# EAGLE design BreadBoardPS_604 (EAGLE 7.1.0)
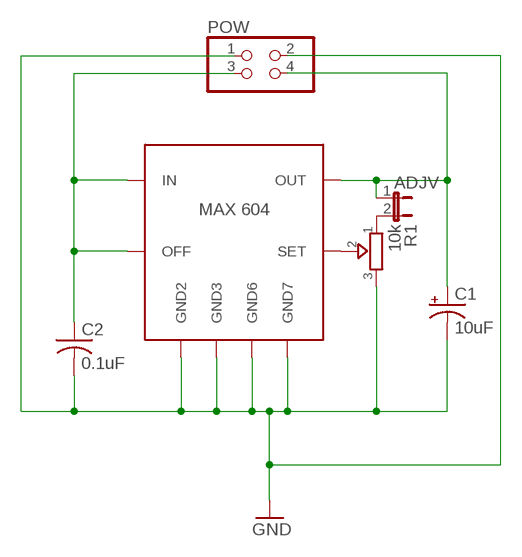
[diagram p0: schematic, sheet 1]

## Parts
ADJV  JP1E  [JP1]
C1  10uF  CPOL-USE2.5-5  [E2,5-5]
C2  0.1uF  C-US025-024X044  [C025-024X044]
MAX604  MAX604  [DIL08]
POW  PINHD-2X22X02/90NOSILK  [2X02/90]
R1  10k  TRIMMER-3306F  [TRIMMER_3306F]

## Nets
GND: C1.- C2.2 MAX604.2(GND2) MAX604.3(GND3) MAX604.6(GND6) MAX604.7(GND7) POW.1 POW.2 R1.3
N$1: C2.1 MAX604.1(IN) MAX604.4(OFF) POW.3
N$2: ADJV.2 R1.1
N$3: MAX604.5(SET) R1.2
N$5: ADJV.1 C1.+ MAX604.8(OUT) POW.4

## Library data of the parts
ADJV = jumper:JP1E: JUMPER
C1 = rcl:CPOL-US: POLARIZED CAPACITOR, American symbol
C2 = resistor:C-US: CAPACITOR, American symbol
MAX604 = modal:MAX604
POW = pinhead:PINHD-2X2: PIN HEADER
R1 = dp_devices:TRIMMER: Trimmer resistor

## Board
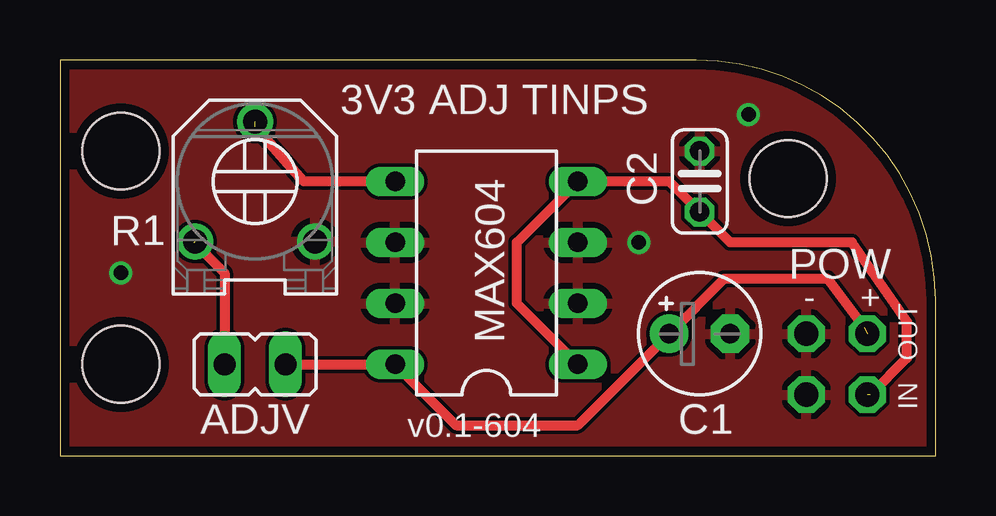
[diagram p1: board, top side]
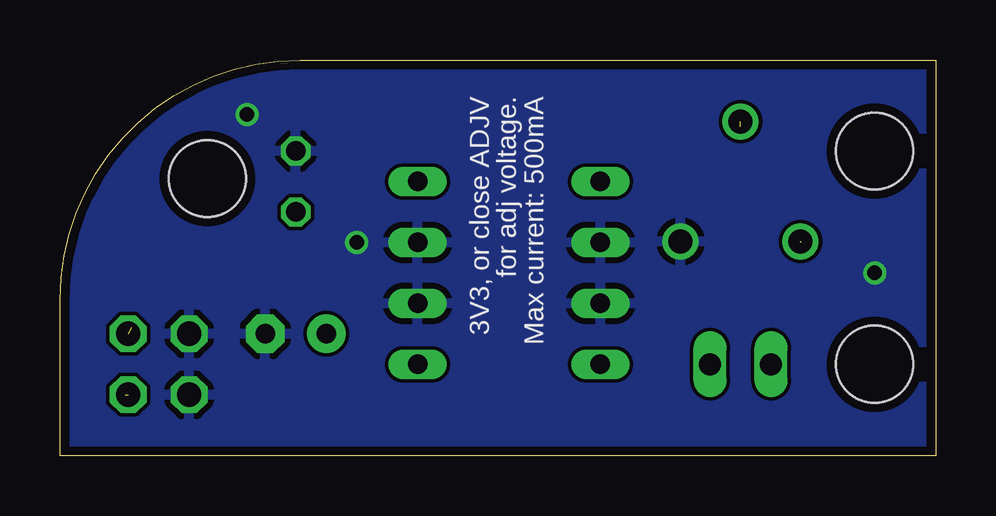
[diagram p2: board, bottom side, seen from below]

Size 36.5 x 16.5 mm. Coordinates in mm from the lower left corner, seen from the top.
Outline: 0,0 36.5,0 36.5,6.5 arc90 26.5,16.5 0,16.5 0,0
Copper layers (1*16): Top 0.0356mm / dielectric 1.5011mm / Bottom 0.0356mm
Design rules "LaenPCBOrder": minimum track width 6mil, minimum drill 13mil, track to track 6mil, track to pad 6mil, pad to pad 6mil, via to via 6mil, smd to smd 6mil, copper to edge 15mil, drill to drill 6mil, minimum pad ring 7mil, minimum via ring 7mil, stop-mask expansion 3mil, vias tented up to drill 0mil, thermal gap 10mil
Holes 3.2 mm at 2.54,12.7 2.54,3.81 30.35,11.56

### Footprints (pad centres in the part's own frame; a part is rotated, then mirrored left to right if it is on the bottom)
JP1 = drill 0.914 long: 1 0,-1.27; 2 0,1.27
E2,5-5 = drill 0.813 pad 1.6: + -1.27,0 | drill 0.813 pad 1.6 octagon: - 1.27,0
C025-024X044 = drill 0.813 octagon: 1 -1.27,0; 2 1.27,0
DIL08 = drill 0.813 long: 1 -3.81,-3.81; 2 -1.27,-3.81; 3 1.27,-3.81; 4 3.81,-3.81; 5 3.81,3.81; 6 1.27,3.81; 7 -1.27,3.81; 8 -3.81,3.81
2X02/90 = drill 1.016 octagon: 1 -1.27,-6.35; 2 -1.27,-3.81; 3 1.27,-6.35; 4 1.27,-3.81
TRIMMER_3306F = drill 1: 1 -2.5,-2.5; 2 0,2.5; 3 2.5,-2.5

### Placement (x,y rotation side)
ADJV  8.13,3.81 90 top
C1  26.67,5.08 0 top
C2  26.67,11.43 90 top
MAX604  17.78,7.62 90 top
POW  32.38,8.89 0 top
R1  8.13,11.43 0 top

### Tracks (layer width: path | path; a pad name or v marks a point on that pad's centre or on a via)
GND  (via drill 0.6)
  other vias: 2.54,7.62 28.7,14.22 24.13,8.89
  pour Top: -1.27,17.78 -1.27,-1.27 41.91,-1.27 41.91,17.78
  pour Bottom: -1.27,17.78 -1.27,-1.27 41.91,-1.27 41.91,17.78
N$1  (1 unrouted)
  Top 0.406: MAX604.1 19.05,6.35 19.05,8.89 MAX604.4 25.4,11.43 C2.1 27.94,8.89 33.02,8.89 35.31,5.59 35.31,4.06 33.78,2.54
N$2  (1 unrouted)
  Top 0.406: 5.59,8.89 6.86,7.62 ADJV.2
N$3  (1 unrouted)
  Top 0.406: MAX604.5 10.16,11.43 8.13,13.72
N$5  (1 unrouted)
  Top 0.406: 33.53,5.33 32,7.37 27.69,7.37 C1.+ 21.59,1.27 16.51,1.27 MAX604.8 ADJV.1

### Text on the board
tNames: 3V3 ADJ TINPS | - | + | OUT | IN | v0.1-604
bNames: 3V3, or close ADJV / for adj voltage. / Max current: 500mA